# EAGLE design Schematics (EAGLE 6.0)
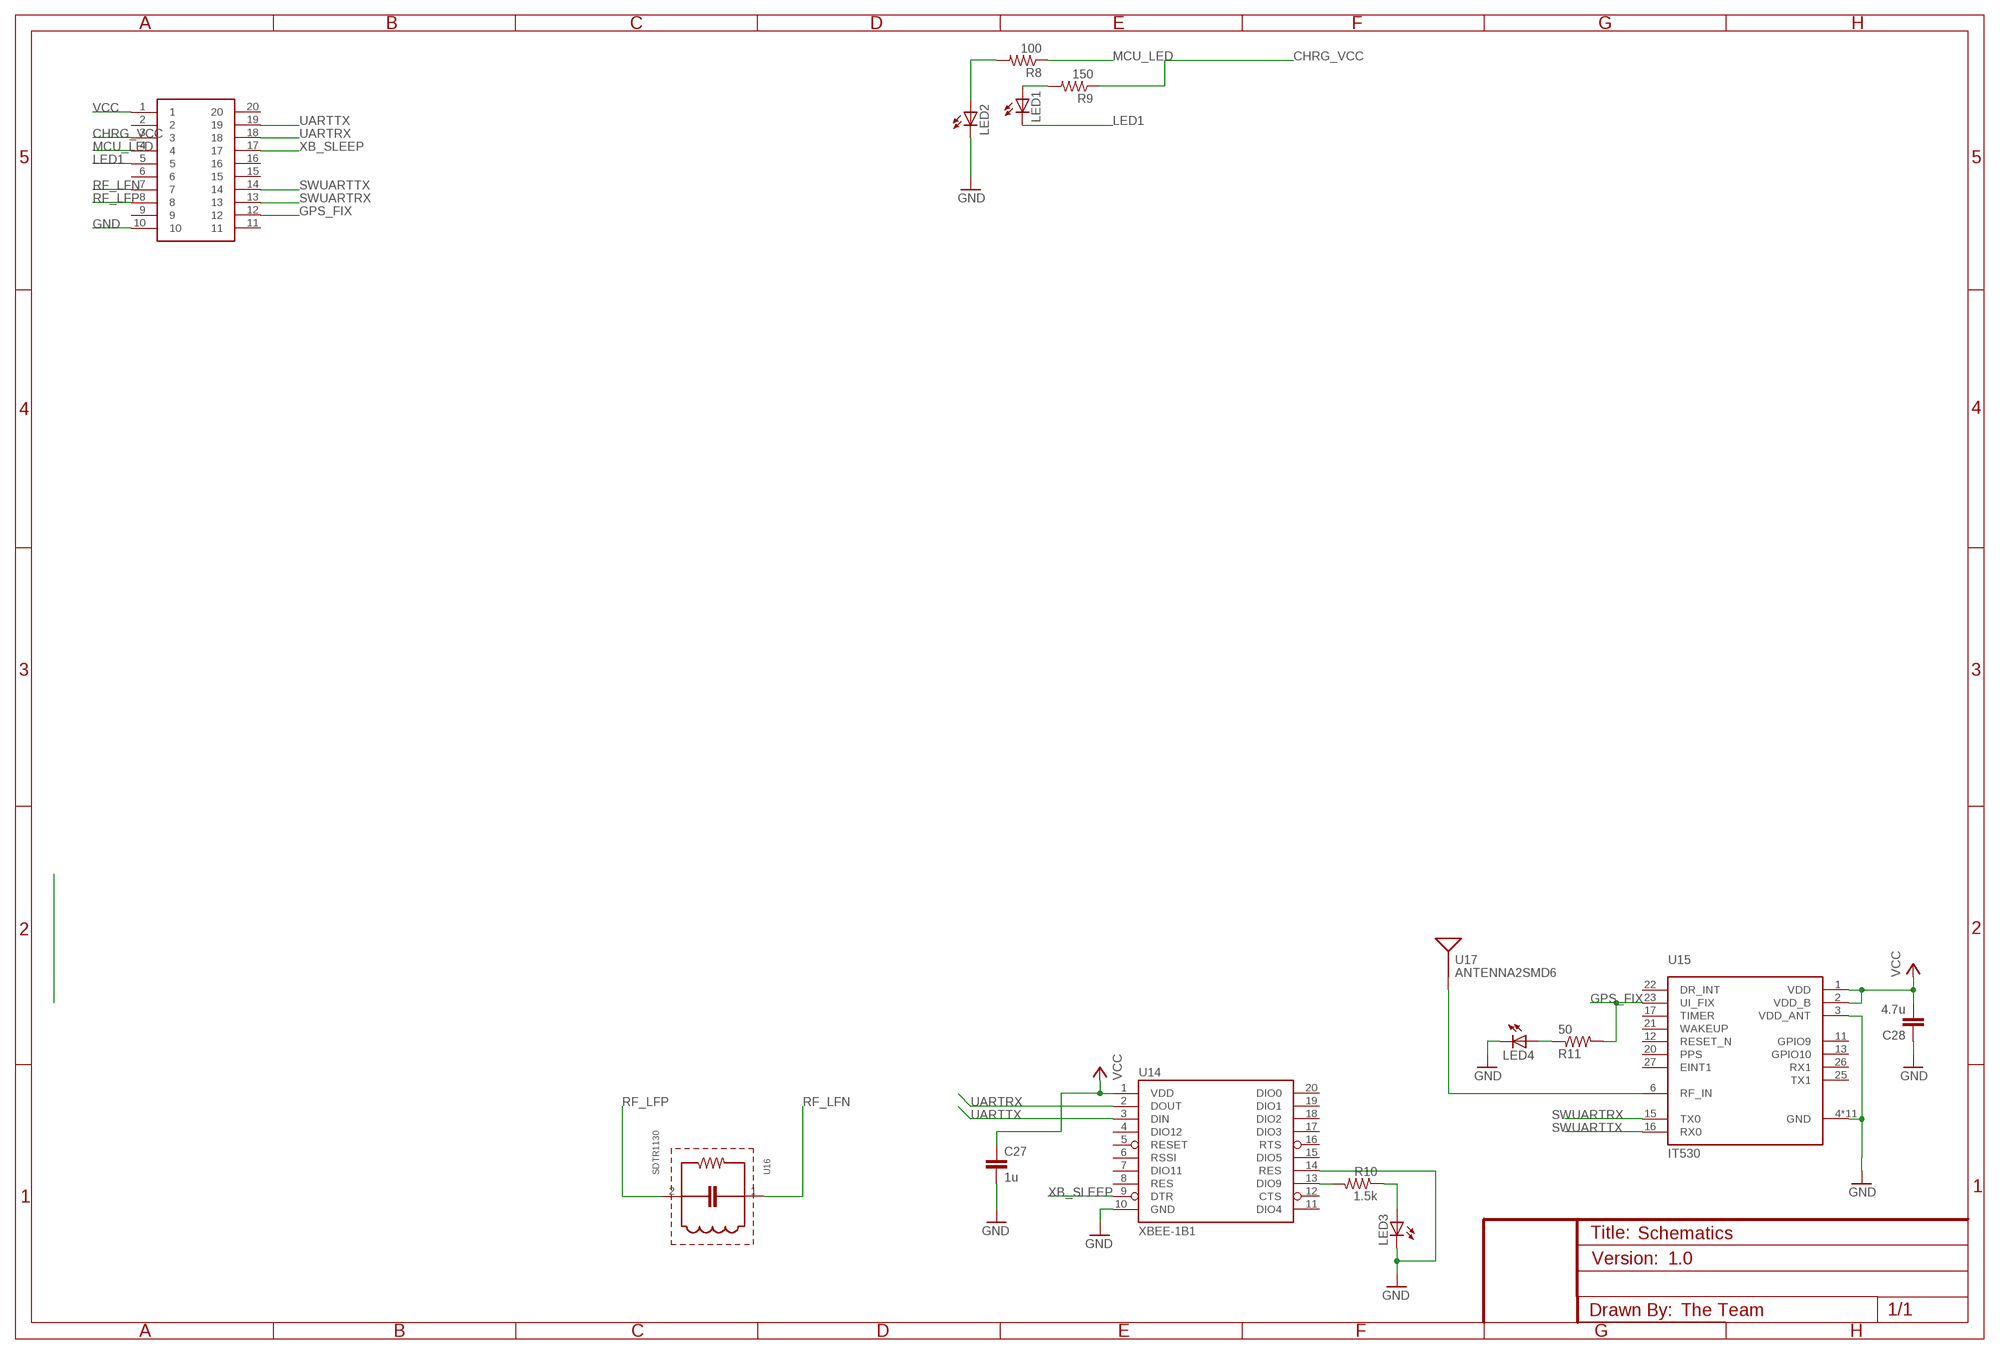
[diagram p0: schematic, sheet 1]

## Parts
C27  1u  C-EUC0603  [C0603]
C28  4.7u  C-EUC0603  [C0603]
JP4  20-HEAD  [20-HEAD]
LED1  LED  [SMARTLED-TTW]
LED2  LED  [SMARTLED-TTW]
LED3  LED  [SMARTLED-TTW]
LED4  LED  [SMARTLED-TTW]
R8  100  R-US_R0603  [R0603]
R9  150  R-US_R0603  [R0603]
R10  1.5k  R-US_R0603  [R0603]
R11  50  R-US_R0603  [R0603]
U14  XBEE-1B1  [XBEE-1]
U15  IT530  [IT530]
U16  SDTR1130  [SDTR1130-SMD]
U17  ANTENNA2SMD6  [ANTENNA-CHIP6]

## Nets
CHRG_VCC: JP4.3 R9.1
GND: C27.2 C28.1 JP4.10 LED2.C@1(C) LED3.C@1(C) LED4.C@1(C) U14.10(GND) U14.14(RES) U15.3(VDD_ANT) U15.4(GND) U15.5(GND) U15.7(GND) U15.8(GND) U15.9(GND) U15.10(GND) U15.14(GND) U15.18(GND) U15.19(GND) U15.24(GND) U15.28(GND)
GPS_FIX: JP4.12 R11.2 U15.23(UI_FIX)
LED1: JP4.5 LED1.C@1(C)
MCU_LED: JP4.4 R8.1
N$1: LED4.A@1(A) R11.1
N$3: LED3.A@1(A) R10.1
N$4: R10.2 U14.13(DIO9)
N$14: U15.6(RF_IN) U17.1(SIGNAL)
N$36: LED1.A@1(A) R9.2
N$41: LED2.A@1(A) R8.2
RF_LFN: JP4.7 U16.1
RF_LFP: JP4.8 U16.2
SWUARTRX: JP4.13 U15.15(TX0)
SWUARTTX: JP4.14 U15.16(RX0)
UARTRX: JP4.18 U14.2(DOUT)
UARTTX: JP4.19 U14.3(DIN)
VCC: C27.1 C28.2 JP4.1 U14.1(VDD) U15.1(VDD) U15.2(VDD_B)
XB_SLEEP: JP4.17 U14.9(DTR)
Unconnected: JP4.2 JP4.6 JP4.9 JP4.11 JP4.15 JP4.16 JP4.20 U14.4(DIO12) U14.5(RESET) U14.6(RSSI) U14.7(DIO11) U14.8(RES) U14.11(DIO4) U14.12(CTS) U14.15(DIO5) U14.16(RTS) U14.17(DIO3) U14.18(DIO2) U14.19(DIO1) U14.20(DIO0) U15.11(GPIO9) U15.12(RESET_N) U15.13(GPIO10) U15.17(TIMER) U15.20(PPS) U15.21(WAKEUP) U15.22(DR_INT) U15.25(TX1) U15.26(RX1) U15.27(EINT1)

## Library data of the parts
C27 C28 = rcl:C-EU: CAPACITOR, European symbol
JP4 = Micro2:20-HEAD
LED1-LED4 = led:LED: LED OSRAM: - CHIPLED LG R971, LG N971, LY N971, LG Q971, LY Q971, LO R971, LY R971 LH N974, LH R974 LS Q976, LO Q976, LY Q976 LO Q996 - Hyper CHIPLED LW Q18S LB Q993, LB Q99A, LB R99A - SideLED LS A670, LO A670, LY A670, LG A670, LP A670 LB A673, LV A673, LT A673, LW A673 LH A674 LY A675 LS A676, LA A676, LO A676, LY A676, LW A676 LS A679, LY A679, LG A679 - Hyper Micro SIDELED® LS Y876, LA Y876, LO Y876, LY Y876 LT Y87S - SmartLED LW L88C, LW L88S LB L89C, LB L89S, LG L890 LS L89K, LO L89K, LY L89K LS L896, LA L896, LO L896, LY L896 - TOPLED LS T670, LO T670, LY T670, LG T670, LP T670 LSG T670, LSP T670, LSY T670, LOP T670, LYG T670 LG T671, LOG T671, LSG T671 LB T673, LV T673, LT T673, LW T673 LH T674 LS T676, LA T676, LO T676, LY T676, LB T676, LH T676, LSB T676, LW T676 LB T67C, LV T67C, LT T67C, LS T67K, LO T67K, LY T67K, LW E67C LS E67B, LA E67B, LO E67B, LY E67B, LB E67C, LV E67C, LT E67C LW T67C LS T679, LY T679, LG T679 LS T770, LO T770, LY T770, LG T770, LP T770 LB T773, LV T773, LT T773, LW T773 LH T774 LS E675, LA E675, LY E675, LS T675 LS T776, LA T776, LO T776, LY T776, LB T776 LHGB T686 LT T68C, LB T68C - Hyper Mini TOPLED® LB M676 - Mini TOPLED Santana® LG M470 LS M47K, LO M47K, LY M47K Source: http://www.osram.convergy.de LUXEON: - LUMILED® LXK2-PW12-R00, LXK2-PW12-S00, LXK2-PW14-U00, LXK2-PW14-V00 LXK2-PM12-R00, LXK2-PM12-S00, LXK2-PM14-U00 LXK2-PE12-Q00, LXK2-PE12-R00, LXK2-PE12-S00, LXK2-PE14-T00, LXK2-PE14-U00 LXK2-PB12-K00, LXK2-PB12-L00, LXK2-PB12-M00, LXK2-PB14-N00, LXK2-PB14-P00, LXK2-PB14-Q00 LXK2-PR12-L00, LXK2-PR12-M00, LXK2-PR14-Q00, LXK2-PR14-R00 LXK2-PD12-Q00, LXK2-PD12-R00, LXK2-PD12-S00 LXK2-PH12-R00, LXK2-PH12-S00 LXK2-PL12-P00, LXK2-PL12-Q00, LXK2-PL12-R00 Source: www.luxeon.com KINGBRIGHT: KA-3528ASYC Source: www.kingbright.com
R8-R11 = rcl:R-US_: RESISTOR, American symbol
U14 = SparkFun-RF:XBEE-1: Xbee module footprints SMT header is CONN-09042.
U15 = Micro2:IT530: IT530 Datasheet <http://www.u-blox.com/images/downloads/Product_Docs/IT530_DataSheet_%28FTX-HW-12008%29.pdf>
U16 = Micro2:SDTR1130
U17 = SparkFun-RF:ANTENNA2: Chip antenna Single endded antenna. Common with smaller chip antennas. CHIP4 package is the GPS Chip Antenna SKU: GPS-08418. CHIP5 package is 2.4GHz chip antenna SKU: WRL-00144.

## Board
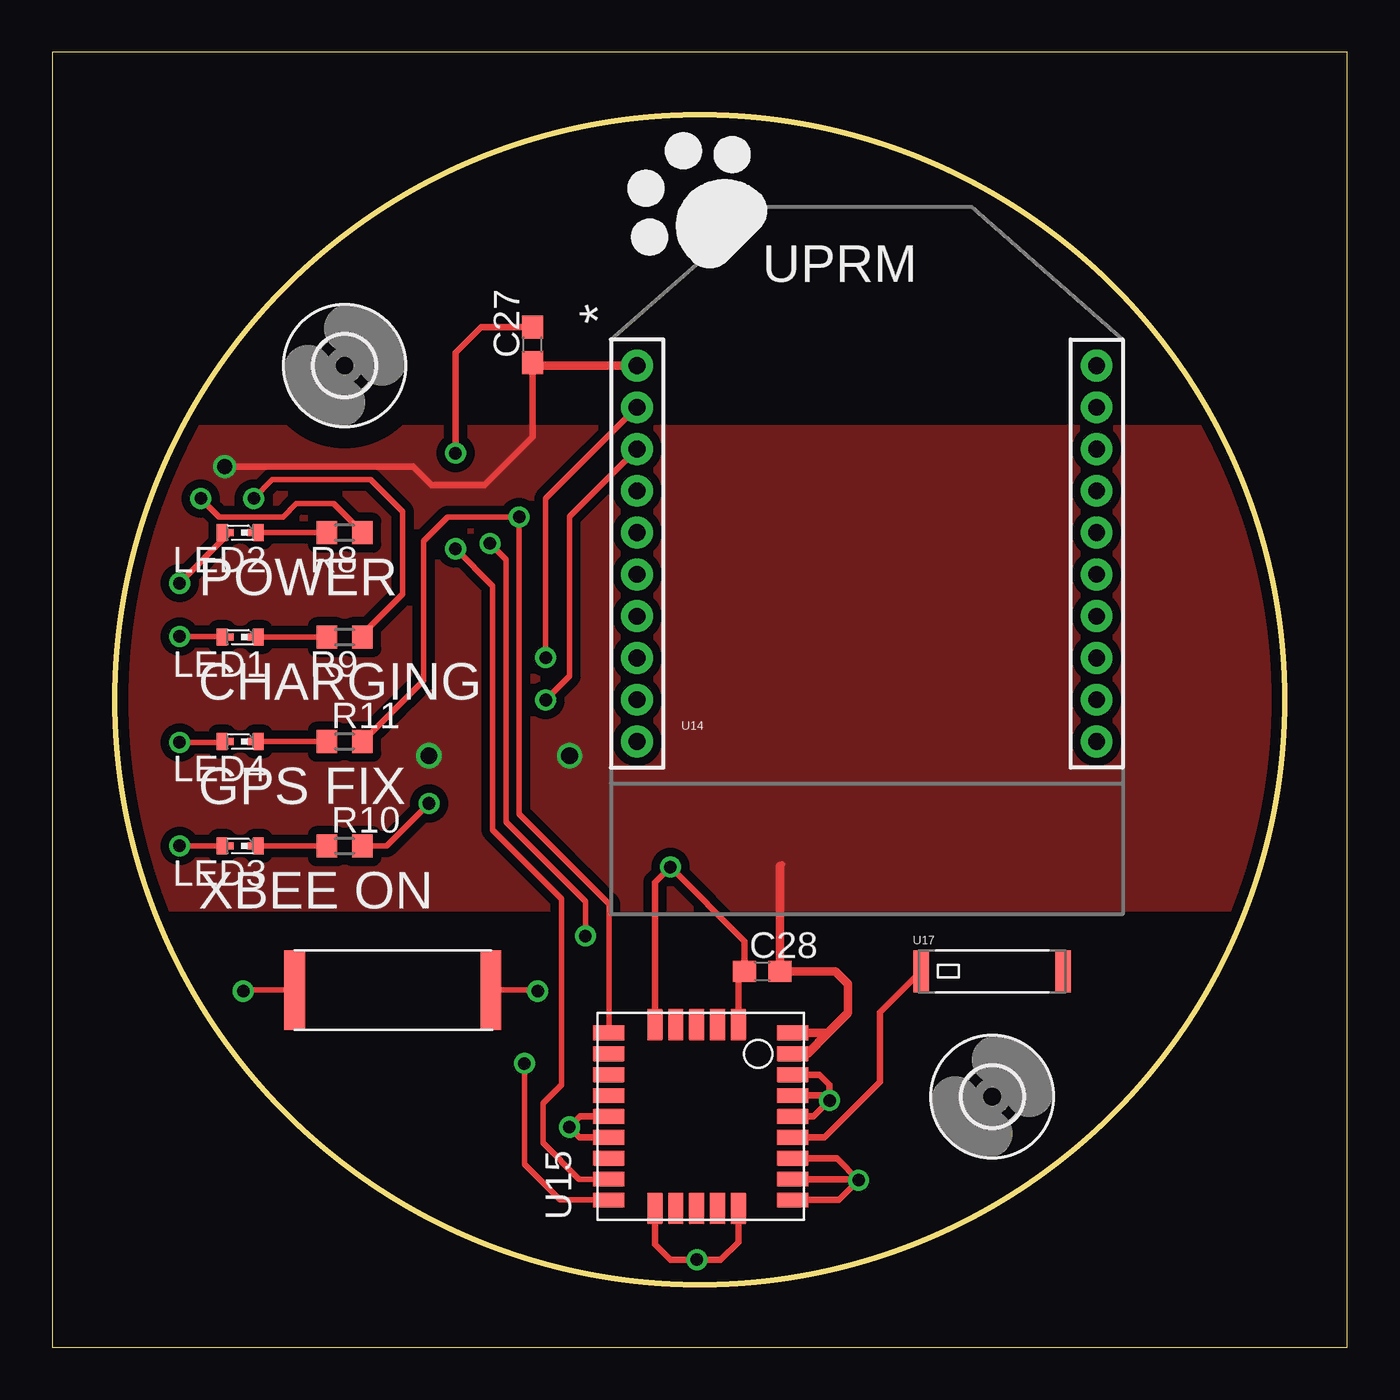
[diagram p1: board, top side]
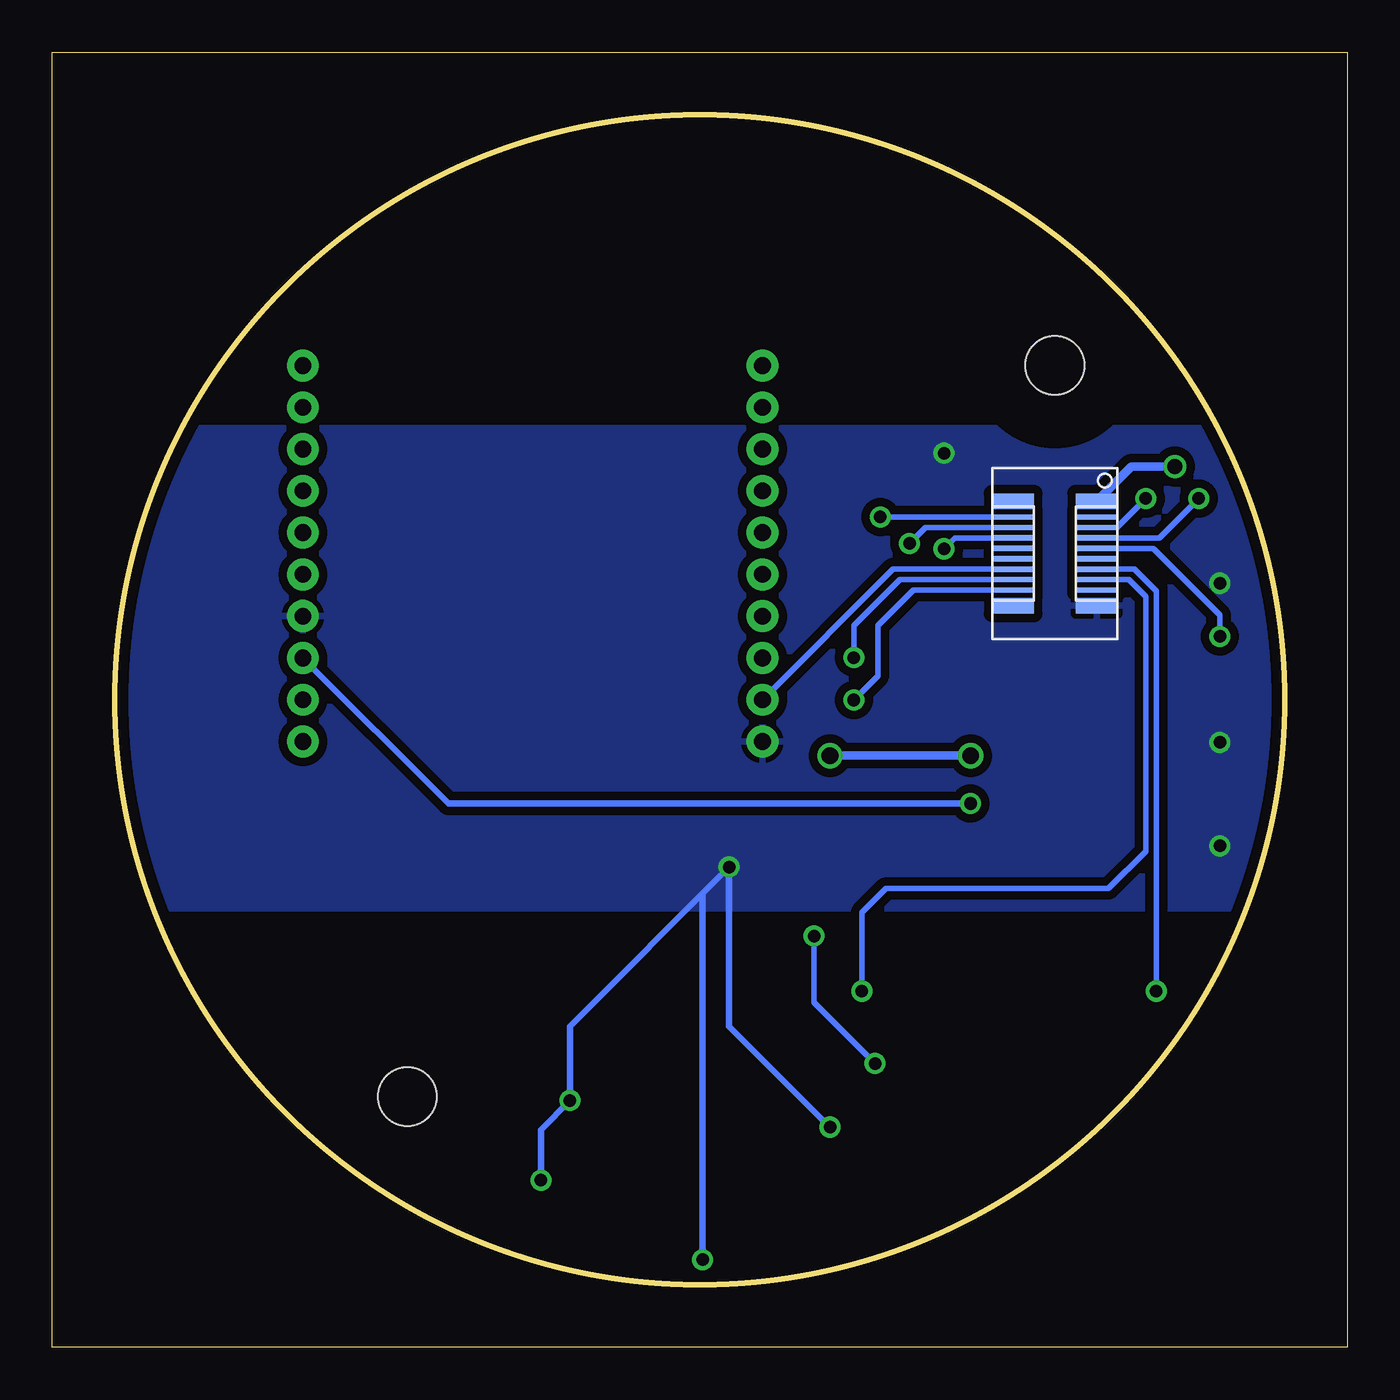
[diagram p2: board, bottom side, seen from below]

Size 62 x 62 mm. Coordinates in mm from the lower left corner, seen from the top.
Outline: 0,0 62,0 62,62 0,62 0,0
Outline: circle at 31,31 radius 28
Copper layers (1*16): Top 0.0178mm / dielectric 59mil / Bottom 0.0178mm
Design rules: minimum track width 6mil, minimum drill 14mil, track to track 6mil, track to pad 6mil, pad to pad 6mil, via to via 6mil, smd to smd 6mil, copper to edge 20mil, drill to drill 16mil, minimum pad ring 8mil, minimum via ring 8mil, stop-mask expansion 3mil, vias tented up to drill 0mil, thermal gap 10mil

### Footprints (pad centres in the part's own frame; a part is rotated, then mirrored left to right if it is on the bottom)
C0603 = smd 1.1 x 1: 1 -0.85,0; 2 0.85,0
20-HEAD = smd 0.75 x 2: 1 -2.5,2; 10 2.5,2; 11 -2.5,-2; 20 2.5,-2 | smd 0.25 x 2: 2 -1.75,2; 3 -1.25,2; 4 -0.75,2; 5 -0.25,2; 6 0.25,2; 7 0.75,2; 8 1.25,2; 9 1.75,2; 12 -1.75,-2; 13 -1.25,-2; 14 -0.75,-2; 15 -0.25,-2; 16 0.25,-2; 17 0.75,-2; 18 1.25,-2; 19 1.75,-2
SMARTLED-TTW = smd 0.8 x 0.5: A 0,-0.875; C 0,0.875 | smd 0.35 x 0.35: A@1 0,-0.5; C@1 0,0.5
R0603 = smd 1 x 1.1: 1 -0.85,0; 2 0.85,0
XBEE-1 = drill 0.8 pad 1.524: 1 -11,20; 2 -11,18; 3 -11,16; 4 -11,14; 5 -11,12; 6 -11,10; 7 -11,8; 8 -11,6; 9 -11,4; 10 -11,2; 11 11,2; 12 11,4; 13 11,6; 14 11,8; 15 11,10; 16 11,12; 17 11,14; 18 11,16; 19 11,18; 20 11,20
IT530 = smd 0.711 x 1.422: 1 -0.95,0.55; 2 -1.95,0.55; 3 -2.95,0.55; 4 -3.95,0.55; 5 -4.95,0.55; 6 -5.95,0.55; 7 -6.95,0.55; 8 -7.95,0.55; 9 -8.95,0.55; 15 -8.95,9.35; 16 -7.95,9.35; 17 -6.95,9.35; 18 -5.95,9.35; 19 -4.95,9.35; 20 -3.95,9.35; 21 -2.95,9.35; 22 -1.95,9.35; 23 -0.95,9.35 | smd 1.422 x 0.711: 10 -9.35,3.15; 11 -9.35,4.15; 12 -9.35,5.15; 13 -9.35,6.15; 14 -9.35,7.15; 24 -0.55,7.15; 25 -0.55,6.15; 26 -0.55,5.15; 27 -0.55,4.15; 28 -0.55,3.15
SDTR1130-SMD = smd 1 x 3.8: 1 9.4,1.9; 2 0,1.9
ANTENNA-CHIP6 = smd 0.75 x 2: 1 -3.4,0; NC 3.4,0
2,8 = hole 2.8: 0,0

### Placement (x,y rotation side)
C27  23,48 90 top
C28  34,18 0 top
JP4  14,38 270 bottom
LED1  9,34 90 top
LED2  9,39 90 top
LED3  9,24 90 top
LED4  9,29 90 top
R8  14,39 180 top
R9  14,34 180 top
R10  14,24 0 top
R11  14,29 0 top
U14  39,27 0 top
U15  36,16 90 top
U16  21,19 180 top
U17  45,18 0 top
U$4  [2,8]  14,47 0 top
U$5  [2,8]  45,12 0 top

### Tracks (layer width: path | path; a pad name or v marks a point on that pad's centre or on a via)
CHRG_VCC  (via drill 0.6)
  Top 0.254: v9.65,40.64 10.54,41.53 15.24,41.53 16.76,40.01 16.76,36.07 14.85,34.15 R9.1
  Bottom 0.254: JP4.3 11.04,39.25 v9.65,40.64
GND  (via drill 0.6)
  Top 0.254: LED3.C@1 v6.1,24 | LED4.C@1 8.46,28.96 v6.1,28.96 | LED2.C@1 6.1,36.6 v6.1,36.58
  Top 0.305: C27.2 20.53,48.85 19.3,47.62 v19.3,42.8 | U15.28 32.85,18 C28.1 33.15,19.43 v29.59,22.99 28.85,22.25 U15.24 | U15.14 28.85,4.93 29.59,4.19 v30.86,4.19 32,4.19 32.85,5.04 U15.10 | U15.8 38.56,8.05 v38.61,8 | U15.9 37.66,7.05 v38.61,8 | U15.7 37.56,9.05 v38.61,8 | U15.4 36.97,12.05 v37.21,11.81 | U15.3 36.73,13.05 37.21,12.57 v37.21,11.81 | U15.5 36.45,11.05 v37.21,11.81 | U15.19 25.27,11.05 v24.77,10.54 25.26,10.05 U15.18
  Bottom 0.305: v30.86,4.19 30.86,21.72 v29.59,22.99 | v38.61,8 38.61,10.41 v37.21,11.81 37.21,15.37 v29.59,22.99 | v24.77,10.54 29.59,15.37 v29.59,22.99
  pour Bottom (isolate 0.406): 3,28 3,34 6,44 56,44 59,34 59,28 57,21 5,21
GPS_FIX  (via drill 0.6)
  Top 0.254: U15.23 26.65,21.23 22.35,25.53 v22.35,39.75 18.92,39.75 17.78,38.61 17.78,31.93 R11.2
  Bottom 0.254: JP4.12 v22.35,39.75
LED1  (via drill 0.6)
  Top 0.254: LED1.C@1 8.46,34.04 v6.1,34.04
  Bottom 0.254: JP4.5 9.29,38.25 6.1,35.05 v6.1,34.04
MCU_LED  (via drill 0.6)
  Top 0.254: v7.11,40.64 8,39.75 11.05,39.75 11.68,40.39 13.46,40.39 R8.1
  Bottom 0.254: JP4.4 9,38.75 v7.11,40.64
N$1
  Top 0.254: LED4.A@1 R11.1
N$3
  Top 0.254: LED3.A@1 R10.1
N$4  (via drill 0.6)
  Top 0.254: v18.03,26.04 16,24 R10.2
  Top 0.305: 18,26 v18.03,26.04
  Bottom 0.305: v18.03,26.04 43.03,26.04 U14.13
N$14
  Top 0.305: U15.6 36.97,10.05 39.62,12.7 39.62,16.02 U17.1
N$36
  Top 0.254: LED1.A@1 R9.2
N$41
  Top 0.254: LED2.A@1 R8.2
RF_LFN  (via drill 0.6)
  Top 0.254: U16.1 9.19,17.1 v9.14,17.05
  Bottom 0.254: JP4.7 10.2,37.25 9.14,36.2 v9.14,17.05
RF_LFP  (via drill 0.6)
  Top 0.254: U16.2 23.19,17.1 v23.24,17.05
  Bottom 0.254: JP4.8 10.46,36.75 9.65,35.94 9.65,23.75 11.43,21.97 22.1,21.97 23.24,20.83 v23.24,17.05
SWUARTRX  (via drill 0.6)
  Top 0.254: v20.95,38.48 21.72,37.72 21.72,25.15 25.53,21.34 v25.53,19.68 | v22.61,13.59 22.61,8.76 24.32,7.05 U15.15
  Bottom 0.254: JP4.13 20.19,39.25 v20.95,38.48 | v25.53,19.68 25.53,16.51 v22.61,13.59
SWUARTTX  (via drill 0.6)
  Top 0.254: v19.3,38.23 21.08,36.45 21.08,24.77 24.38,21.46 24.38,12.57 23.5,11.68 23.5,9.78 25.22,8.05 U15.16
  Bottom 0.254: JP4.14 18.78,38.75 v19.3,38.23
UARTRX  (via drill 0.6)
  Top 0.254: v23.62,33.02 23.62,40.62 U14.2
  Bottom 0.254: JP4.18 21.42,36.75 23.62,34.54 v23.62,33.02
UARTTX  (via drill 0.6)
  Top 0.254: v23.62,30.99 24.77,32.13 24.77,39.77 U14.3
  Bottom 0.254: JP4.19 20.77,36.25 22.48,34.54 22.48,32.13 v23.62,30.99
VCC  (via drill 0.7, 0.8)
  Top 0.305: 23,47.13 C27.1 23,43.57 20.7,41.27 18.16,41.27 17.27,42.16 v8.26,42.16 | 34.85,23.04 34.92,23.11
  Top 0.406: C27.1 23.15,47 U14.1 | U15.1 37.15,15.05 | 37.15,15.05 38.1,16 38.1,17.4 37.5,18 C28.2 34.85,23.04 | U15.2 36.15,14.05 37.15,15.05
  Bottom 0.406: JP4.1 10.34,42.16 v8.26,42.16 | v18.03,28.32 v24.77,28.32
  pour Top (isolate 0.406): 3,28 3,34 6,44 56,44 59,34 59,28 57,21 5,21
XB_SLEEP
  Bottom 0.254: U14.9 21.75,37.25 JP4.17

### Text on the board
tPlace: UPRM | * | POWER | CHARGING | GPS FIX | XBEE ON